# Altium schematic sheet Reference.SchDoc: Ultrastable Reference
size 558 x 431 mm; SheetNumber: 3; SheetTotal: 8
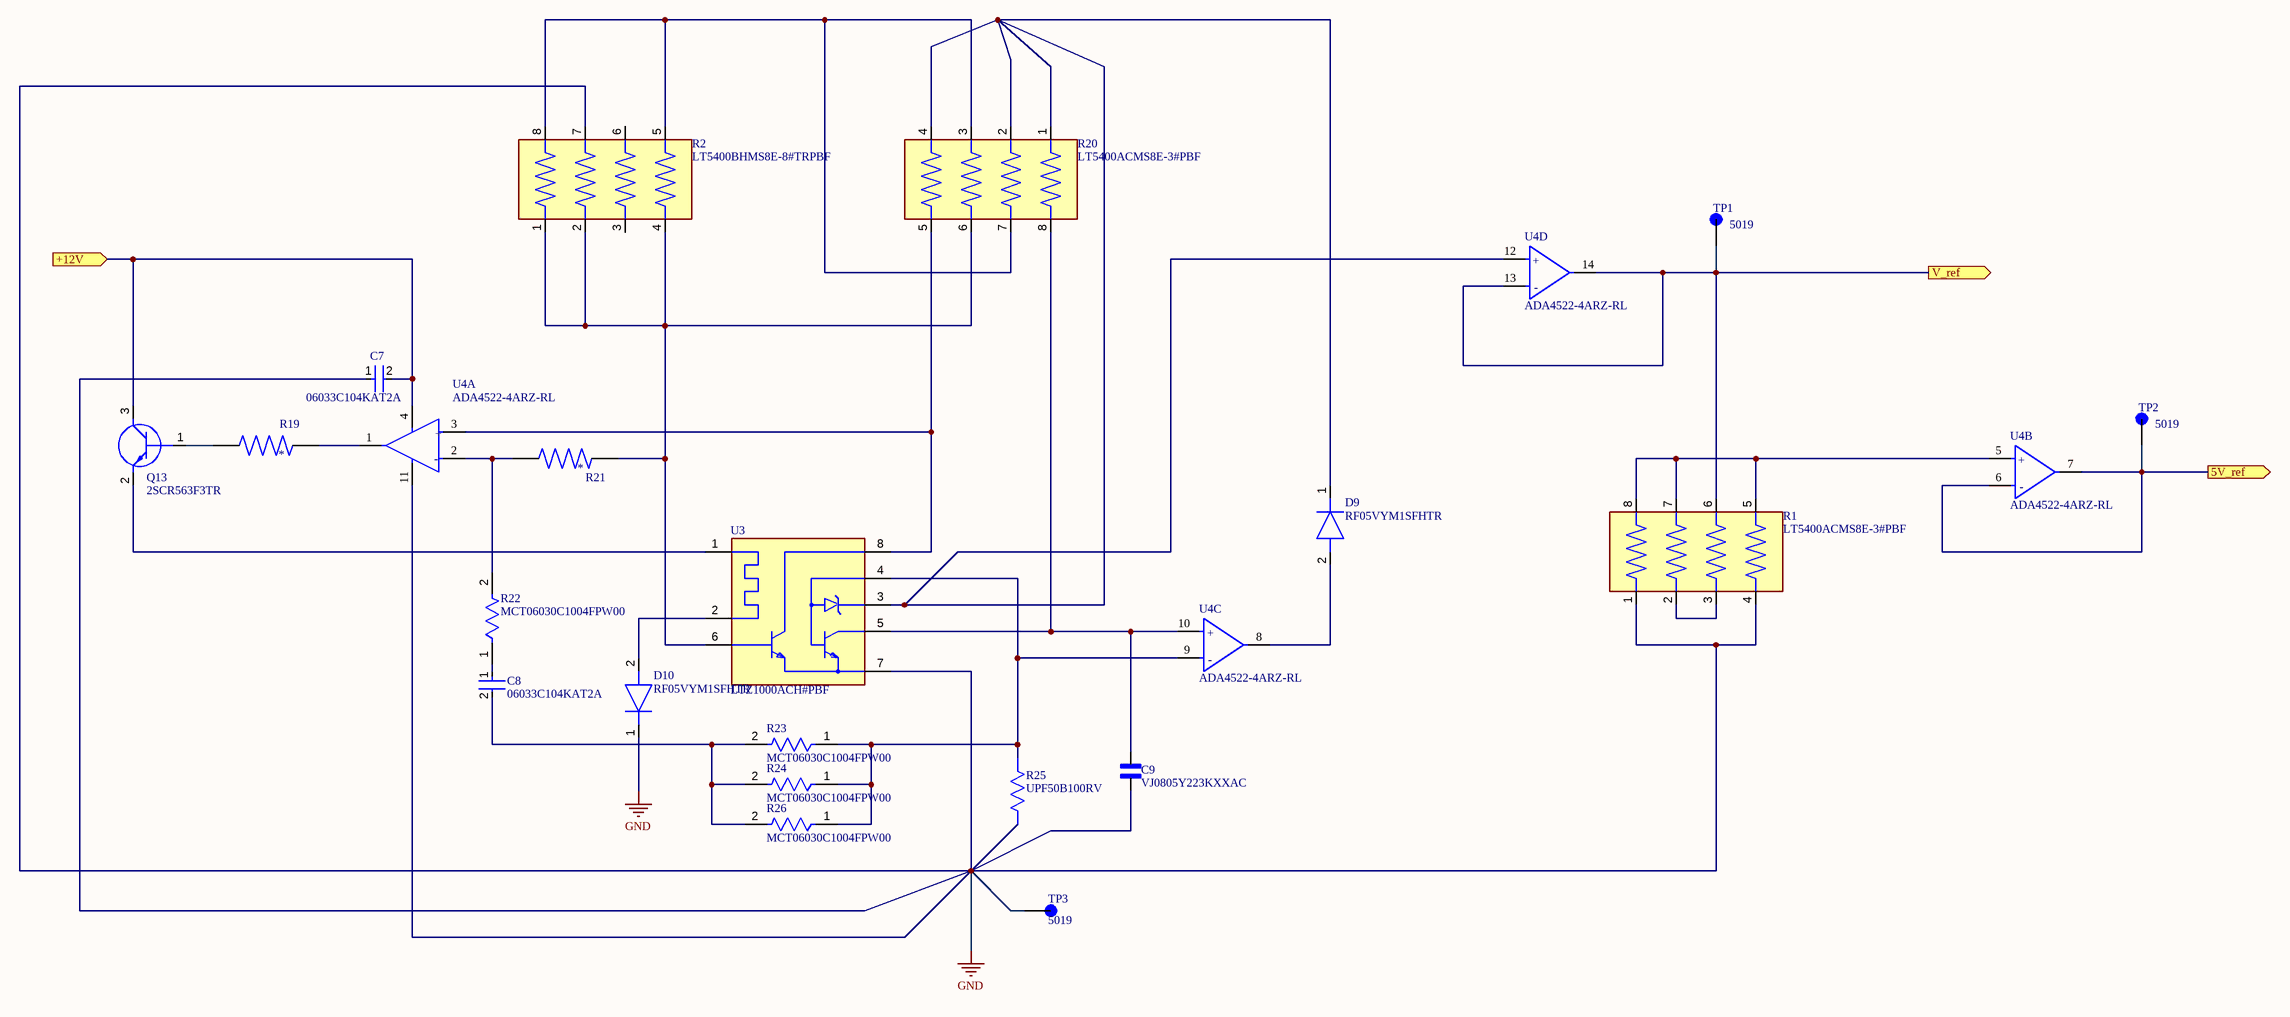
[diagram p0: Reference.SchDoc]

## Parts
C7  06033C104KAT2A  [FP-0603-L_1_6_0_15-W_0_81-MFG]
C8  06033C104KAT2A  [FP-0603-L_1_6_0_15-W_0_81-MFG]
C9  VJ0805Y223KXXAC  [CAPC2012X145N]
D9  RF05VYM1SFHTR  [RF05VYM1SFHTR]
D10  RF05VYM1SFHTR  [RF05VYM1SFHTR]
Q13  2SCR563F3TR  [2SAR542F3]
R1  LT5400ACMS8E-3#PBF  [SOP65P490X110-9N]
R2  LT5400BHMS8E-8#TRPBF  [SOP65P490X110-9N]
R19  MCT06030C1001FP500  [RESC1508X55N]  (value not drawn)
R20  LT5400ACMS8E-3#PBF  [SOP65P490X110-9N]
R21  MCT06030C1001FP500  [RESC1508X55N]  (value not drawn)
R22  MCT06030C1004FPW00  [FP-MCT0603-MFG]
R23  MCT06030C1004FPW00  [FP-MCT0603-MFG]
R24  MCT06030C1004FPW00  [FP-MCT0603-MFG]
R25  UPF50B100RV  [RES_UPF50B2K0V_TEC]
R26  MCT06030C1004FPW00  [FP-MCT0603-MFG]
TP1  5019  [KEYSTONE_5019]
TP2  5019  [KEYSTONE_5019]
TP3  5019  [KEYSTONE_5019]
U3  LTZ1000ACH#PBF  [FP-H-8-05-08-1320-MFG]
U4  ADA4522-4ARZ-RL  [FP-R-14-IPC_C]  (parts A,B,C,D of 4)

## Ports
5V_ref (out, see CoverSchematic[5C], TempEnhanced[5D], TempEnhanced[5F]), +12V (in, see CoverSchematic[6C], Lownoise_auxReg[4D], SolidStateDosimeter[5C], TemperatureMon[5D], TemperatureMon[6E], TemperatureMon[8D]), V_ref (out, see CoverSchematic[5C])

## Nets
GND: C7.1 C9.1 D10.1(K) R1.1 R1.4 R2.7 R25.1 TP3.TP U3.7(E) U4.11(V-)
5V_ref: TP2.TP U4.6(-IN_B) U4.7(OUT_B) ; port 5V_ref
+12V: C7.2 Q13.3(C) U4.4(V+) ; port +12V
V_ref: R1.6 TP1.TP U4.13(-IN_D) U4.14(OUT_D) ; port V_ref
NetC8_1: C8.1 R22.1
NetC8_2: C8.2 R23.2 R24.2 R26.2
NetC9_2: C9.2 R20.8 U3.5(C) U4.10(+IN_C)
NetD9_1: D9.1(K) R20.1 R20.2 R20.4 U3.3(ZENER+) U4.12(+IN_D)
NetD9_2: D9.2(A) U4.8(OUT_C)
NetD10_2: D10.2(A) U3.2(HEATER-)
NetQ13_1: Q13.1(B) R19.1
NetQ13_2: Q13.2(E) U3.1(HEATER+)
NetR1_2: R1.2 R1.3
NetR1_5: R1.5 R1.7 R1.8 U4.5(+IN_B)
NetR2_1: R2.1 R2.2 R2.4 R20.6 R21.2 U3.6(B)
NetR2_5: R2.5 R2.8 R20.3 R20.7
NetR19_2: R19.2 U4.1(OUT_A)
NetR20_5: R20.5 U3.8(C) U4.3(+IN_A)
NetR21_1: R21.1 R22.2 U4.2(-IN_A)
NetR23_1: R23.1 R24.1 R25.2 R26.1 U3.4(SUBSTRATE/ZENER-) U4.9(-IN_C)

Not connected (* = marked no-connect by the designer): Q13 4(C_2); R2 3 6

## Notes on the sheet
- DWG. NO.
- REV.
- SHT.
- REVISION
- DESCRIPTION
- DATE
- APPROVED
- THIS DOCUMENT AND THE DATA DISCLOSED HEREIN OR HEREWITH IS THE PROPERTY OF ALTIUM LIMITED AND MAY BE FREELY DISTRIBUTED IN WHOLE. NO RIGHTS ARE RESERVED OR EXPRESS OR IMPLIED WARANTEE GIVEN.
- PROJECT
- TITLE
- SCALE:
- C
- SIZE
- CAGE CODE
- FILE NAME
- DWG by:
- Heitor Sampaio Mendes
- SHEET
- OF
- REV
- (in symbol CMP-09116-000280-1, part A) +; -
- (in symbol CMP-09116-000280-1, part B) +; -
- (in symbol CMP-09116-000280-1, part C) +; -
- (in symbol CMP-09116-000280-1, part D) +; -

## Library data of the parts
C7 C8 = CMP-2006-04157-2: General Purpose Ceramic Capacitor, 0603, 100nF, 10%, X7R, 15%, 25V; Termination: SMD/SMT; Voltage Rating: 25V; Mount: Surface Mount; Number of Pins: 2; Contact Plating: Tin; Case Code (Imperial): 0603; Construction: Flat; Max Operating Temperature: 125°C; Voltage: 25V; Height: 0.9mm; Thickness: 0.035inch; Case Code (Metric): 1608; Case/Package: 0603; Capacitance: 100nF; Length: 1.6mm; Dielectric: X7R; Width: 0.032inch; Series: -; Min Operating Temperature: -55°C; Package Quantity: 4000; REACH SVHC: No SVHC; RoHS Compliant: Yes; Voltage Rating (DC): 25V; Depth: 0.81mm; Packaging: Tape and Reel; Lead Free: Lead Free; Radiation Hardening: No; Tolerance: 10%
C9 = VJ0805Y223KXXAC: MF: {'manufacturer': u'Vishay Vitramon'}; Package: None; Price: None; Value: *; MP: VJ0805Y223KXXAC; Availability: Unavailable
D9 D10 = RF05VYM1SFHTR: Diode; Manufacturer_Name: ROHM Semiconductor; Datasheet Link: https://fscdn.rohm.com/en/products/databook/datasheet/discrete/diode/fast_recovery/rf05vym1sfh.pdf; Height: 0.8mm; Manufacturer_Part_Number: RF05VYM1SFHTR; Mouser Part Number: 755-RF05VYM1SFHTR; Mouser Price/Stock: https://www.mouser.co.uk/ProductDetail/ROHM-Semiconductor/RF05VYM1SFHTR?qs=4v%252BiZTmLVHEBI5apodawUw%3D%3D
Q13 = 2SCR563F3TR: Transistor BJT NPN; Manufacturer_Name: ROHM Semiconductor; Datasheet Link: https://fscdn.rohm.com/en/products/databook/datasheet/discrete/transistor/bipolar/2scr563f3tr-e.pdf; Height: 0.6mm; Manufacturer_Part_Number: 2SCR563F3TR; Mouser Part Number: 755-2SCR563F3TR; Mouser Price/Stock: https://www.mouser.co.uk/ProductDetail/ROHM-Semiconductor/2SCR563F3TR?qs=QNEnbhJQKva43loT1EhzlQ%3D%3D
R1 R20 = LT5400ACMS8E-3#PBF: 1k, 9k Ohm Â±15% 800mW Power Per Element Isolated Resistor Network/Array Â±25ppm/Â°C 8-TSSOP, 8-MSOP (0.118", 3.00mm Width) Exposed Pad; MF: {'manufacturer': u'Analog Devices'}; Package: None; Price: None; Value: *; MP: LT5400ACMS8E-3#PBF; Availability: Unavailable
R2 = LT5400BHMS8E-8#TRPBF: 1k, 9k Ohm Â±15% 800mW Power Per Element Isolated Resistor Network/Array Â±25ppm/Â°C 8-TSSOP, 8-MSOP (0.118", 3.00mm Width) Exposed Pad; MF: {'manufacturer': u'Analog Devices'}; Package: None; Price: None; Value: *; MP: LT5400BHMS8E-8#TRPBF; Availability: Unavailable
R19 R21 = MCT06030C1001FP500: Res Thin Film 0603 1K Ohm 1% 0.1W(1/10W) ?50ppm/C Molded SMD Automotive Medical T/R; MF: {'manufacturer': u'Vishay Beyschlag'}; Value: *; Package: None; Price: None; MP: MCT06030C1001FP500; Availability: Unavailable
R22-R24 R26 = CMP-02407-007592-1: RES SMD 100 OHM 1% 1/8W 0603; Resistance: 1MR; Military Standard: Not; Lead Free: Lead Free; Max Operating Temperature: 125°C; Tolerance: 1%; Min Operating Temperature: -55°C; Length: 1.55mm; Case/Package: 0603; Packaging: Tape and Reel; Composition: Thin Film; Depth: 0.85mm
R25 = UPF50B100RV: No Description Available; Mfr_Name: TE Connectivity
TP1-TP3 = 5019: MF: {'manufacturer': u'Keystone Electronics'}; Package: None; Price: None; Value: *; MP: 5019; Availability: Unavailable
U3 = CMP-09137-000002-1: IC VREF SHUNT 7.2V TO5; Manufacturer: Analog Devices; Number Of Outputs: 1; Output Type: Fixed; Standoff Height: 0.254mm; Reference Type: Buried Zener; Max Junction Temp: +150°C; Octopart: https://octopart.com/ltz1000ach%23pbf-analog+devices-88320833; Temperature Range High: +125°C; Height: 5.969mm; Temperature Range Low: -55°C; ComponentLink2URL: https://www.analog.com/media/en/technical-documentation/data-sheets/LTZ1000.pdf; Digikey Description: IC VREF SHUNT 7.2V TO5; ComponentLink2Description: Datasheet; Ambient Temperature Range High: +125°C; Ambient Temperature Range Low: -55°C; Automotive: No; RoHS: TRUE; Device Class L1: Integrated Circuits (ICs); Package: H-8-05-08-1320; Device Class L2: Power Management ICs; Device Class L3: Voltage References; Manufacturer Part Number: LTZ1000ACH#PBF; Category: IC; Lead Free: Yes; Temperature: -55°C to +125°C
U4 = CMP-09116-000280-1: IC OPAMP ZERO-DRIFT 4CIRC 14SOIC; Min Supply Voltage: 4.5V; Operating Supply Current: 830uA; Input Bias Current: 50pA; Number of Circuits: 4; Common Mode Rejection Ratio: 140dB; Output Current per Channel: 32mA; Slew Rate: 1.7V/µs; Power Supply Rejection Ratio (PSRR): 150dB; Input Offset Voltage (Vos): 1.5uV; Min Dual Supply Voltage: 2.25V; Max Supply Voltage: 55V; Gain Bandwidth Product: 2.7MHz; Max Dual Supply Voltage: 27.5V; Voltage Gain: 137dB; Max Operating Temperature: 125°C; Number of Pins: 14; Case/Package: SOIC; RoHS Compliant: Yes; Packaging: Tape and Reel; Min Operating Temperature: -40°C; Contact Plating: Tin; Lead Free: Contains Lead; Mount: Surface Mount